# EasyEDA Pro project Nova 32kw FRAM piggyback.eprj

# Schematic Schematic1
Board Name: Board1; Create Date: 2026-03-04; Page Name: P1; Project Name: Nova 32kw FRAM piggyback; Schematic Name: Schematic1; Update Date: 2026-03-04; Company: EasyEDA.com; Drawn: Øyvind Hammer; Page Size: A4; Version: V1.0
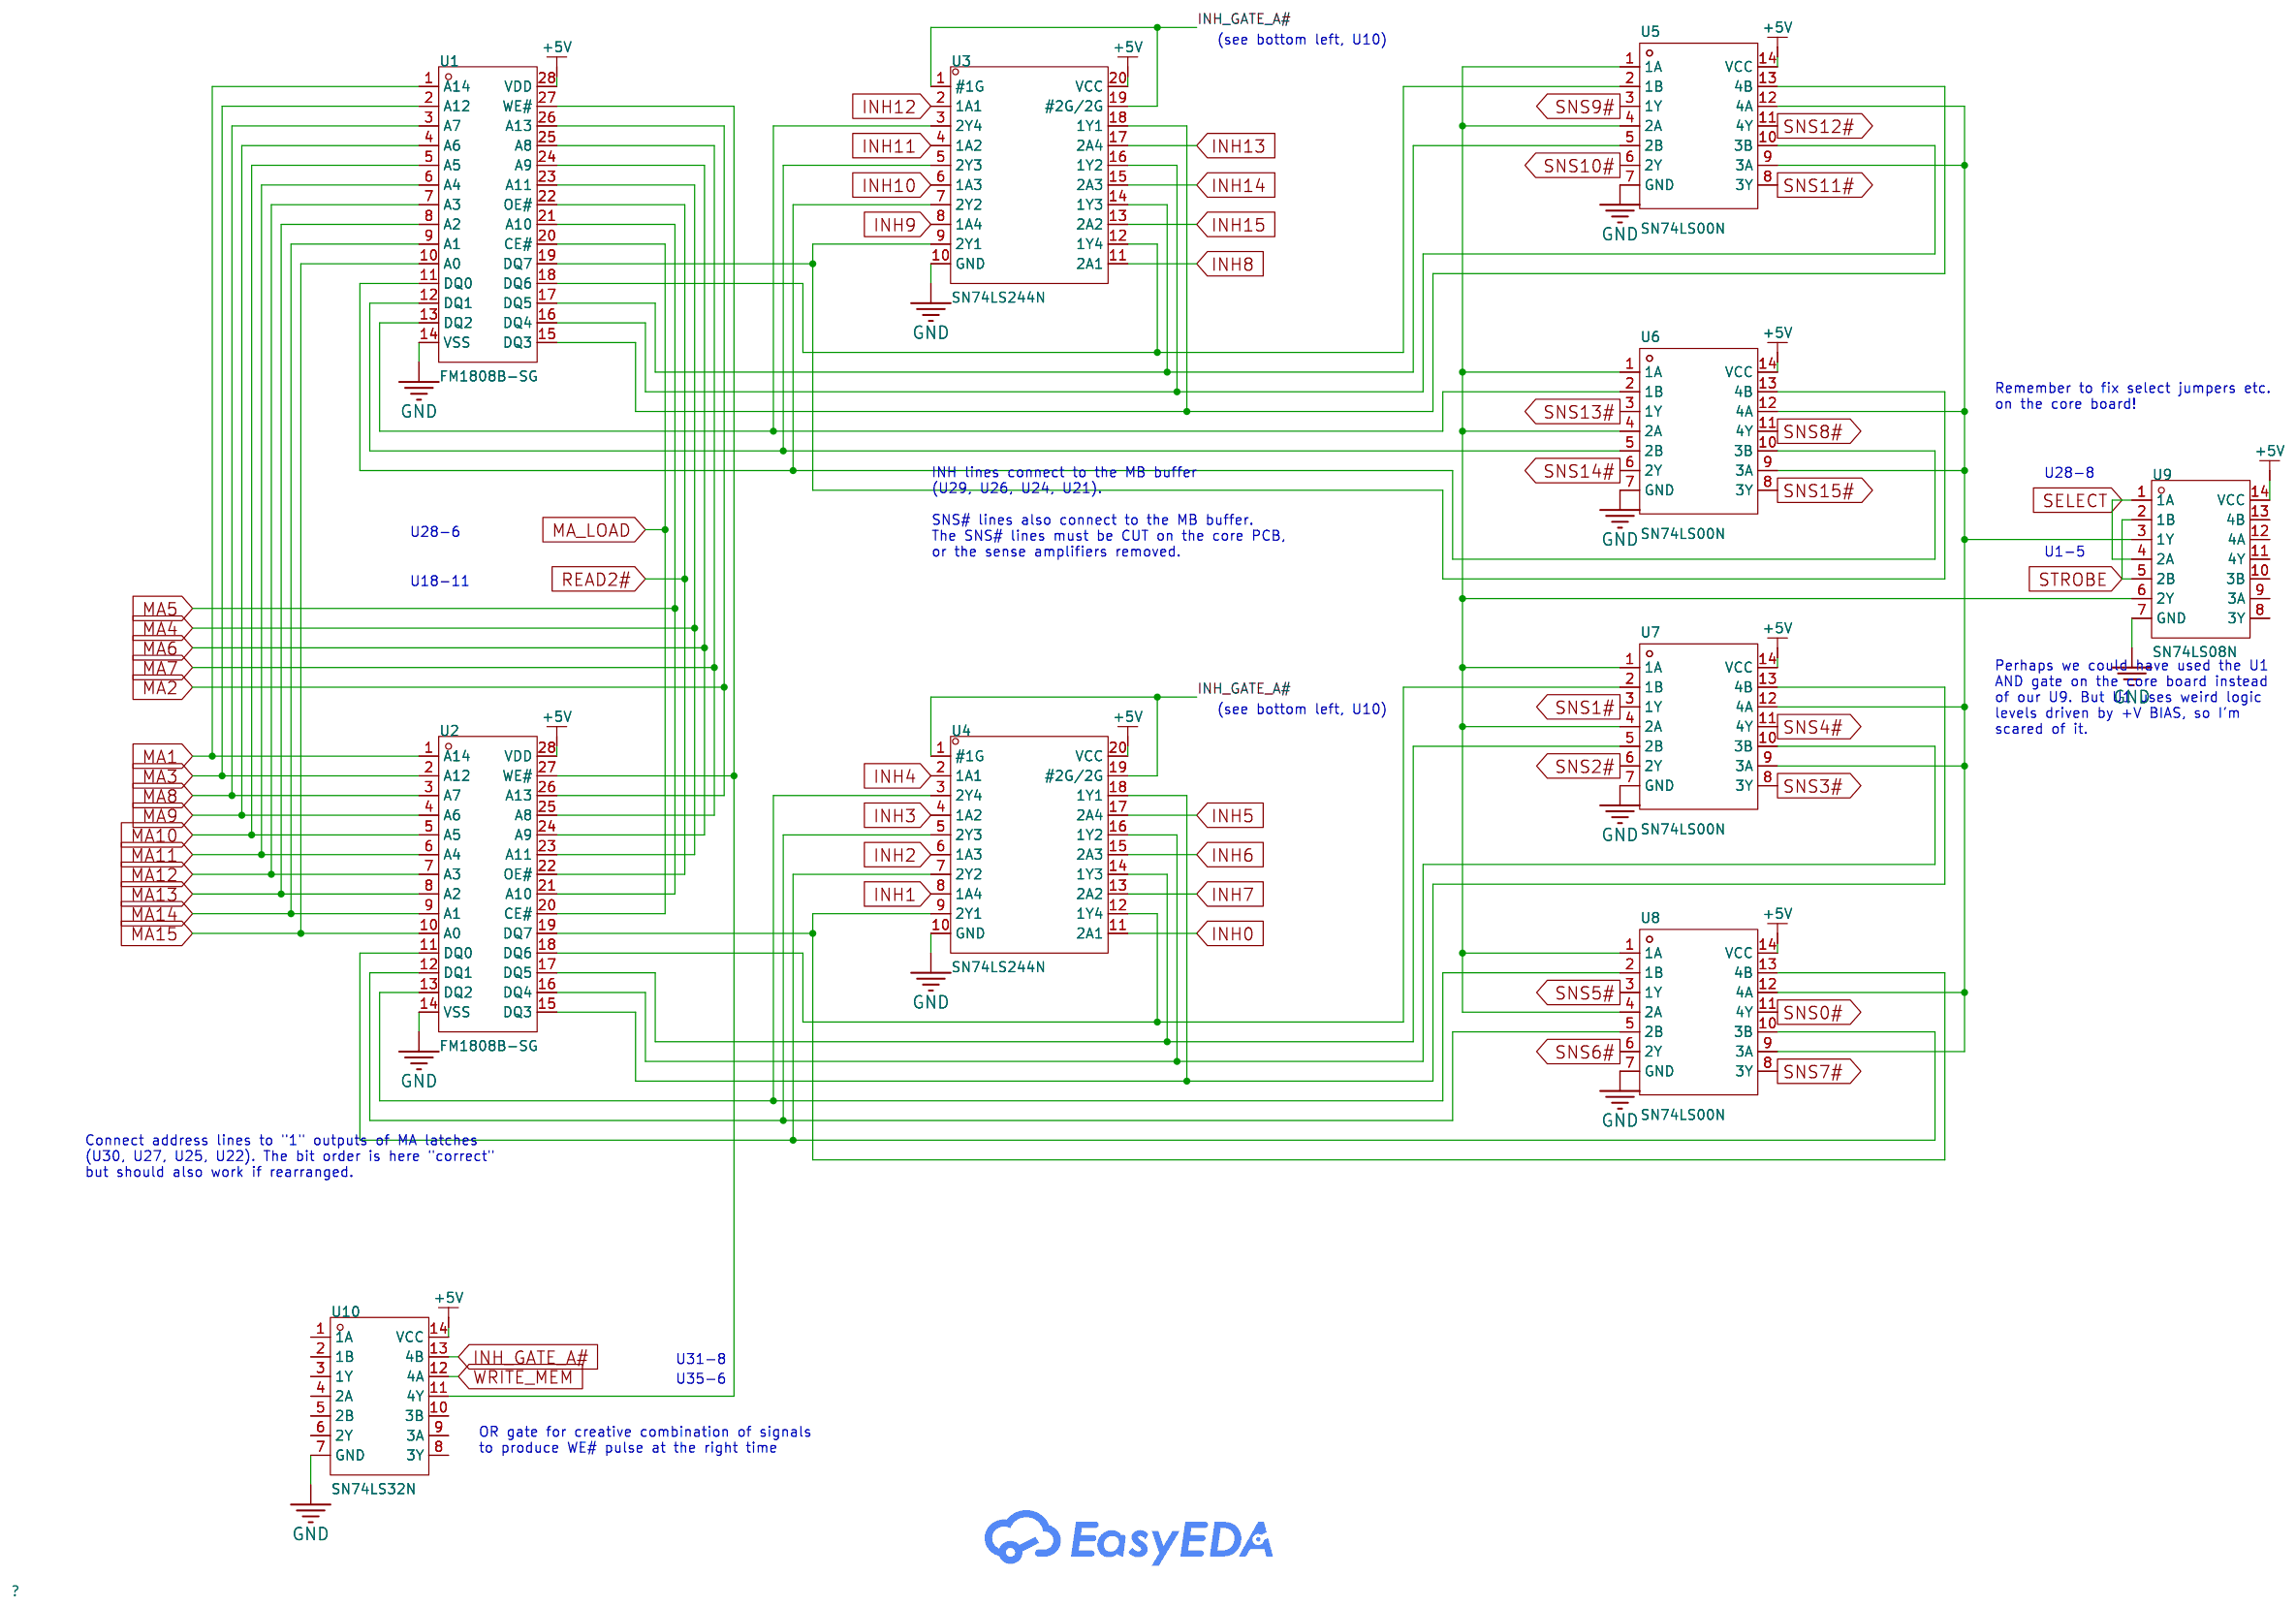
[diagram p0: schematic sheet]

## Parts
U1  FM1808B-SG  [SOIC-28_L17.9-W7.5-P1.27-LS10.3-BL]
U2  FM1808B-SG  [SOIC-28_L17.9-W7.5-P1.27-LS10.3-BL]
U3  SN74LS244N  [DIP-20_L25.5-W10.0-P2.54-LS7.6-BL]
U4  SN74LS244N  [DIP-20_L25.5-W10.0-P2.54-LS7.6-BL]
U5  SN74LS00N  [PDIP-14_L19.7-W6.6-P2.54-LS8.3-BL]
U6  SN74LS00N  [PDIP-14_L19.7-W6.6-P2.54-LS8.3-BL]
U7  SN74LS00N  [PDIP-14_L19.7-W6.6-P2.54-LS8.3-BL]
U8  SN74LS00N  [PDIP-14_L19.7-W6.6-P2.54-LS8.3-BL]
U9  SN74LS08N  [PDIP-14_L19.3-W6.4-P2.54-LS7.9-BL-1]
U10  SN74LS32N  [PDIP-14_L19.6-W6.5-P2.54-LS7.9-BL]

## Library data of the parts
U1 U2 = FM1808B-SG_C2953762: Supplier Part: C2953762; Manufacturer: Infineon/CYPRESS(赛普拉斯); Supplier Footprint: SOIC-28; JLCPCB Part Class: Extended Part; Datasheet: https://item.szlcsc.com/datasheet/FM1808B-SG/3340040.html; Supplier: LCSC; Interface: Parallel; Memory Size: 256Kbit; Voltage - Supply: 4.5V~5.5V; Operating Temperature: -40℃~+85℃
U3 U4 = SN74LS244N: Supplier Part: C352965; Manufacturer: TI(德州仪器); Supplier Footprint: DIP-20; JLCPCB Part Class: Extended Part; Datasheet: https://www.ti.com/cn/lit/gpn/sn74ls244; Supplier: LCSC; Input type: Schmitt trigger; output type: Tri-State; Voltage - Supply: 4.75V~5.25V; Number of Elements: 2; Number of Bits per Element: 4; Channel Type: Unidirectional; Current - Output Low(IOL): 24mA; Current - Output High(IOH): 15mA; Logic Family: 74LS; Operating Temperature: 0℃~+70℃; Quiescent Current: 54mA; Propagation Delay: 12ns@5V,45pF
U5-U8 = SN74LS00N: Supplier Part: C181629; Manufacturer: TI(德州仪器); Supplier Footprint: PDIP-14; JLCPCB Part Class: Extended Part; Datasheet: https://www.ti.com/cn/lit/gpn/sn74ls00; Supplier: LCSC; Logic Type: NAND Gate; Number of Channels: 4; Voltage - Supply: 4.75V~5.25V; Current - Output Low(IOL): 8mA; Current - Output High(IOH): 400uA; Input Logic Level - High: 2V; Input Logic Level - Low: 800mV; Output Logic Level - High: 2.5V; Output Logic Level - Low: 500mV; Series: 74LS Series; Propagation Delay: 15ns@5V,15pF; Operating Temperature: 0℃~+70℃; Input Number: 2
U9 = SN74LS08N: Supplier Part: C2869595; Manufacturer: TI(德州仪器); Supplier Footprint: PDIP-14; JLCPCB Part Class: Extended Part; Datasheet: https://www.ti.com/cn/lit/gpn/sn54s08; Supplier: LCSC; Logic Type: AND Gate; Number of Channels: 4; Voltage - Supply: 4.75V~5.25V; Current - Output Low(IOL): 8mA; Current - Output High(IOH): 400uA; Input Logic Level - High: 2V; Input Logic Level - Low: 800mV; Series: 74LSSeries; Operating Temperature: 0℃~+70℃
U10 = SN74LS32N: LCSC Part Name: 四路二输入正或门; Supplier Part: C273644; Manufacturer: TI(德州仪器); Supplier Footprint: PDIP-14; JLCPCB Part Class: Extended Part; Datasheet: https://www.ti.com/cn/lit/gpn/sn54s32; Supplier: LCSC; Logic Type: OR Gate; Number of Channels: 4; Voltage - Supply: 4.75V~5.25V; Current - Output Low(IOL): 8mA; Current - Output High(IOH): 400uA; Input Logic Level - High: 2V; Input Logic Level - Low: 800mV; Output Logic Level - High: 2.7V~3.4V; Output Logic Level - Low: 350mV~500mV; Series: 74LS Series; Propagation Delay: 22ns@5V,15pF; Operating Temperature: 0℃~+70℃; Input Number: 2

## Nets
+5V: U1.28(VDD) U2.28(VDD) U3.20(VCC) U4.20(VCC) U5.14(VCC) U6.14(VCC) U7.14(VCC) U8.14(VCC) U9.14(VCC) U10.14(VCC)
GND: U1.14(VSS) U2.14(VSS) U3.10(GND) U4.10(GND) U5.7(GND) U6.7(GND) U7.7(GND) U8.7(GND) U9.7(GND) U10.7(GND)
INH0: U4.11(2A1)
INH1: U4.8(1A4)
INH2: U4.6(1A3)
INH3: U4.4(1A2)
INH4: U4.2(1A1)
INH5: U4.17(2A4)
INH6: U4.15(2A3)
INH7: U4.13(2A2)
INH8: U3.11(2A1)
INH9: U3.8(1A4)
INH10: U3.6(1A3)
INH11: U3.4(1A2)
INH12: U3.2(1A1)
INH13: U3.17(2A4)
INH14: U3.15(2A3)
INH15: U3.13(2A2)
INH_GATE_A#: U3.1(#1G) U3.19(#2G/2G) U4.1(#1G) U4.19(#2G/2G) U10.13(4B)
MA1: U1.1(A14) U2.1(A14)
MA2: U1.26(A13) U2.26(A13)
MA3: U1.2(A12) U2.2(A12)
MA4: U1.23(A11) U2.23(A11)
MA5: U1.21(A10) U2.21(A10)
MA6: U1.24(A9) U2.24(A9)
MA7: U1.25(A8) U2.25(A8)
MA8: U1.3(A7) U2.3(A7)
MA9: U1.4(A6) U2.4(A6)
MA10: U1.5(A5) U2.5(A5)
MA11: U1.6(A4) U2.6(A4)
MA12: U1.7(A3) U2.7(A3)
MA13: U1.8(A2) U2.8(A2)
MA14: U1.9(A1) U2.9(A1)
MA15: U1.10(A0) U2.10(A0)
MA_LOAD: U1.20(CE#) U2.20(CE#)
READ2#: U1.22(OE#) U2.22(OE#)
SELECT: U9.1(1A) U9.4(2A)
SNS0#: U8.11(4Y)
SNS1#: U7.3(1Y)
SNS2#: U7.6(2Y)
SNS3#: U7.8(3Y)
SNS4#: U7.11(4Y)
SNS5#: U8.3(1Y)
SNS6#: U8.6(2Y)
SNS7#: U8.8(3Y)
SNS8#: U6.11(4Y)
SNS9#: U5.3(1Y)
SNS10#: U5.6(2Y)
SNS11#: U5.8(3Y)
SNS12#: U5.11(4Y)
SNS13#: U6.3(1Y)
SNS14#: U6.6(2Y)
SNS15#: U6.8(3Y)
STROBE: U9.2(1B) U9.5(2B)
WRITE_MEM: U10.12(4A)
Net-(U1-11): U1.11(DQ0) U3.7(2Y2) U6.10(3B)
Net-(U1-12): U1.12(DQ1) U3.5(2Y3) U6.5(2B)
Net-(U1-13): U1.13(DQ2) U3.3(2Y4) U6.2(1B)
Net-(U1-15): U1.15(DQ3) U3.18(1Y1) U5.13(4B)
Net-(U1-16): U1.16(DQ4) U3.16(1Y2) U5.10(3B)
Net-(U1-17): U1.17(DQ5) U3.14(1Y3) U5.5(2B)
Net-(U1-18): U1.18(DQ6) U3.12(1Y4) U5.2(1B)
Net-(U1-19): U1.19(DQ7) U3.9(2Y1) U6.13(4B)
Net-(U1-27): U1.27(WE#) U2.27(WE#) U10.11(4Y)
Net-(U2-11): U2.11(DQ0) U4.7(2Y2) U8.10(3B)
Net-(U2-12): U2.12(DQ1) U4.5(2Y3) U8.5(2B)
Net-(U2-13): U2.13(DQ2) U4.3(2Y4) U8.2(1B)
Net-(U2-15): U2.15(DQ3) U4.18(1Y1) U7.13(4B)
Net-(U2-16): U2.16(DQ4) U4.16(1Y2) U7.10(3B)
Net-(U2-17): U2.17(DQ5) U4.14(1Y3) U7.5(2B)
Net-(U2-18): U2.18(DQ6) U4.12(1Y4) U7.2(1B)
Net-(U2-19): U2.19(DQ7) U4.9(2Y1) U8.13(4B)
Net-(U5-1): U5.1(1A) U5.4(2A) U6.1(1A) U6.4(2A) U7.1(1A) U7.4(2A) U8.1(1A) U8.4(2A) U9.6(2Y)
Net-(U5-9): U5.9(3A) U5.12(4A) U6.9(3A) U6.12(4A) U7.9(3A) U7.12(4A) U8.9(3A) U8.12(4A) U9.3(1Y)

Not connected (* = marked no-connect by the designer): U9 8(3Y) 9(3A) 10(3B) 11(4Y) 12(4A) 13(4B); U10 1(1A) 2(1B) 3(1Y) 4(2A) 5(2B) 6(2Y) 8(3Y) 9(3A) 10(3B)

## Notes on the sheet
- (see bottom left, U10)
- Remember to fix select jumpers etc.
  on the core board!
- U28-8
- U28-6
- INH lines connect to the MB buffer
  (U29, U26, U24, U21).
  SNS# lines also connect to the MB buffer.
  The SNS# lines must be CUT on the core PCB,
  or the sense amplifiers removed.
- U1-5
- U18-11
- (see bottom left, U10)
- Perhaps we could have used the U1
  AND gate on the core board instead
  of our U9. But U1 uses weird logic
  levels driven by +V BIAS, so I'm
  scared of it.
- Connect address lines to "1" outputs of MA latches
  (U30, U27, U25, U22). The bit order is here "correct"
  but should also work if rearranged.
- U31-8
- U35-6
- OR gate for creative combination of signals
  to produce WE# pulse at the right time
